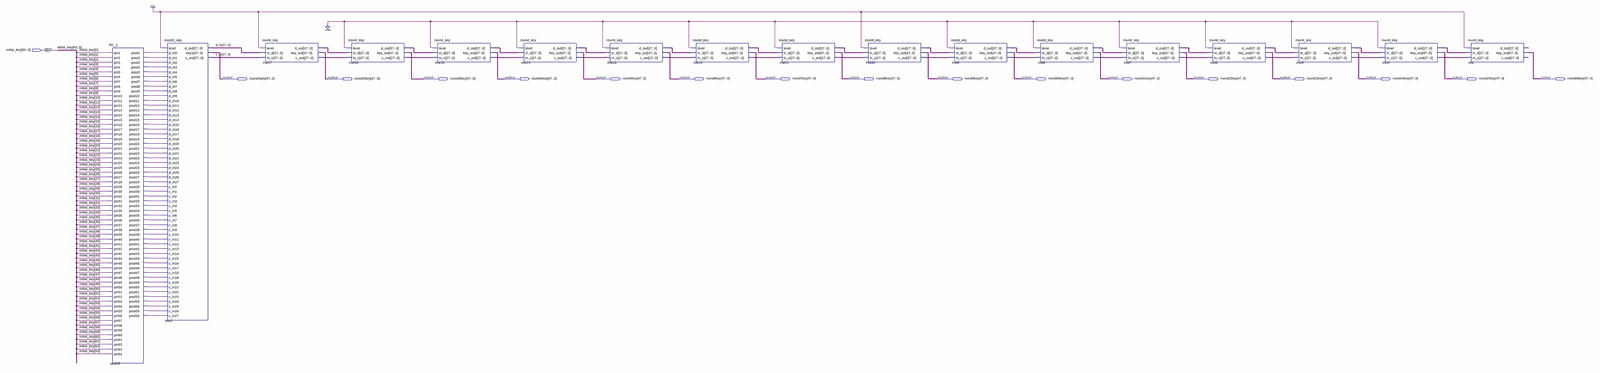
[diagram p0: schematic sheet, whole]
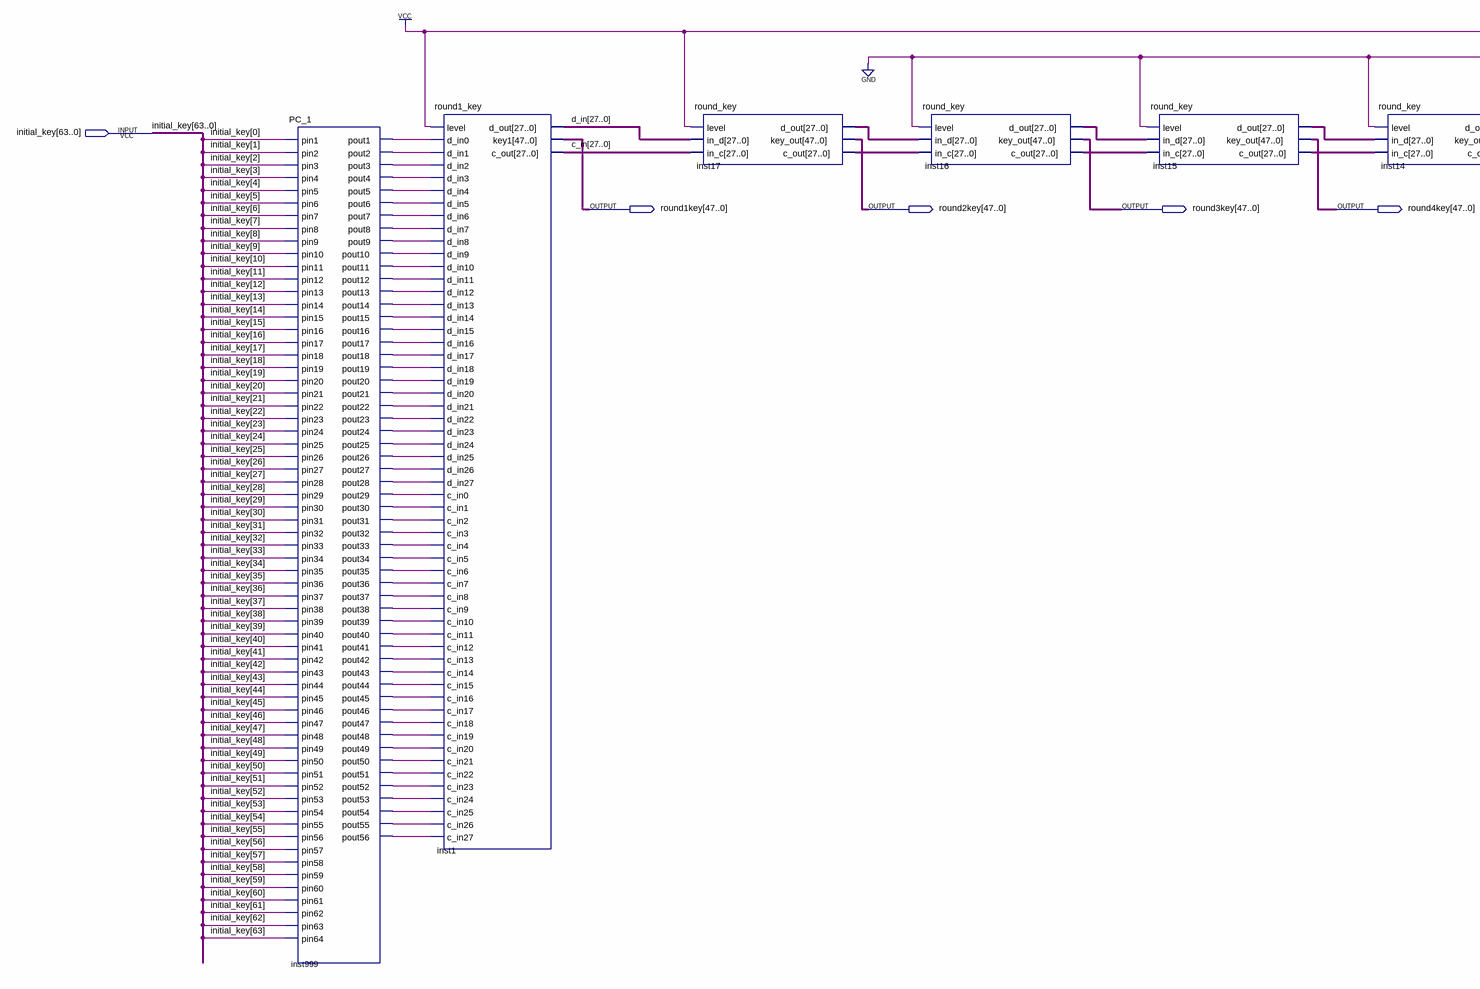
[diagram p1: schematic sheet, left part]
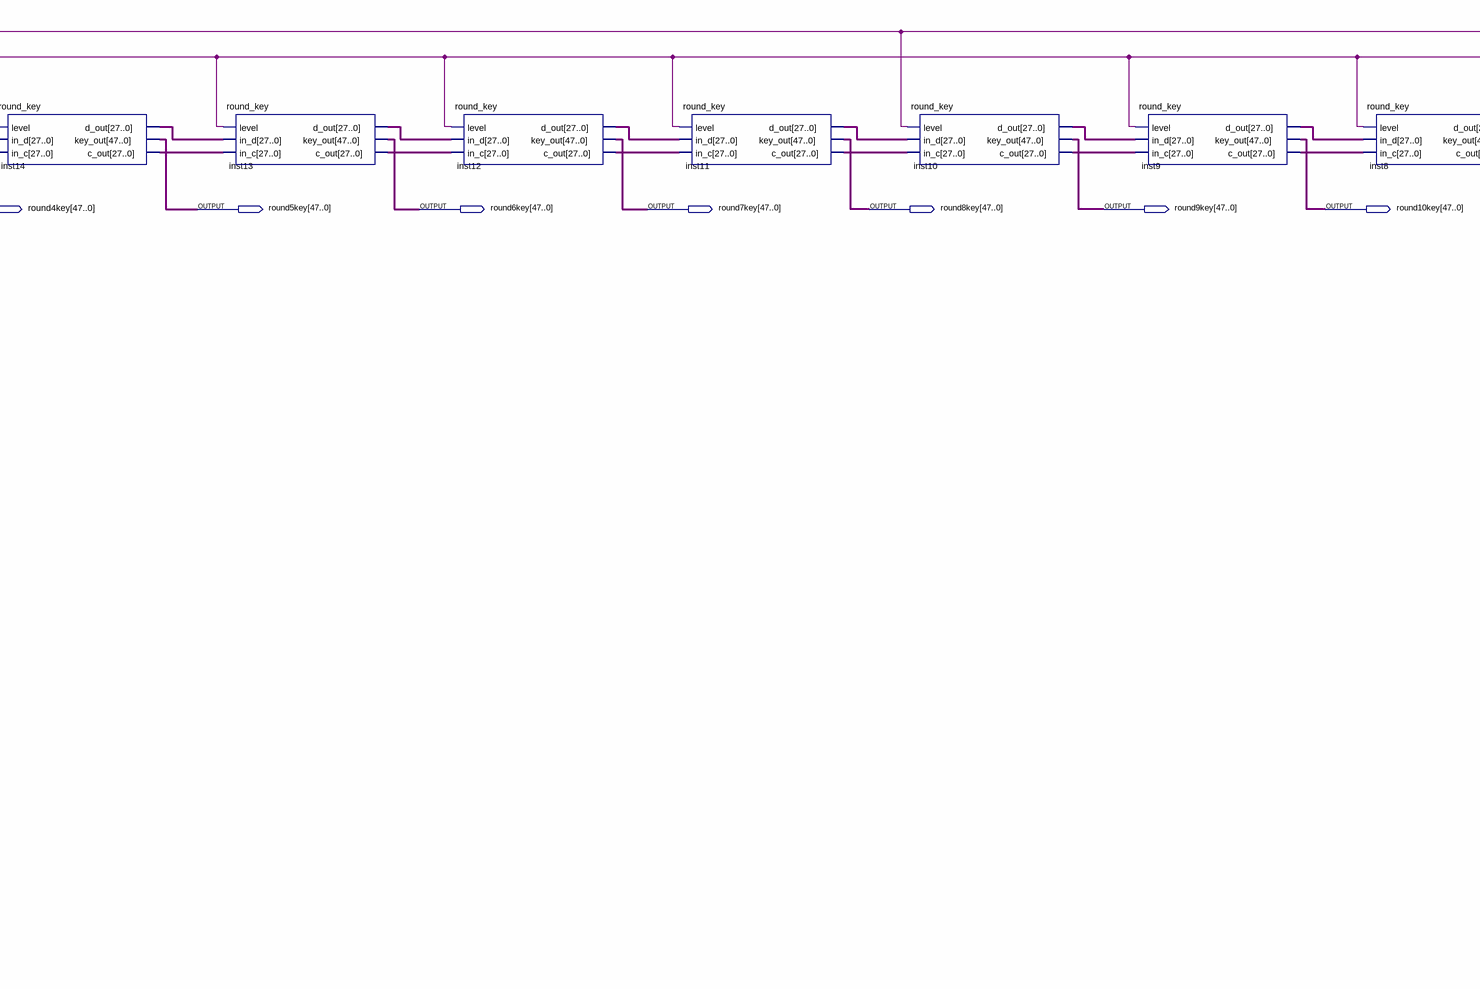
[diagram p2: schematic sheet, centre part]
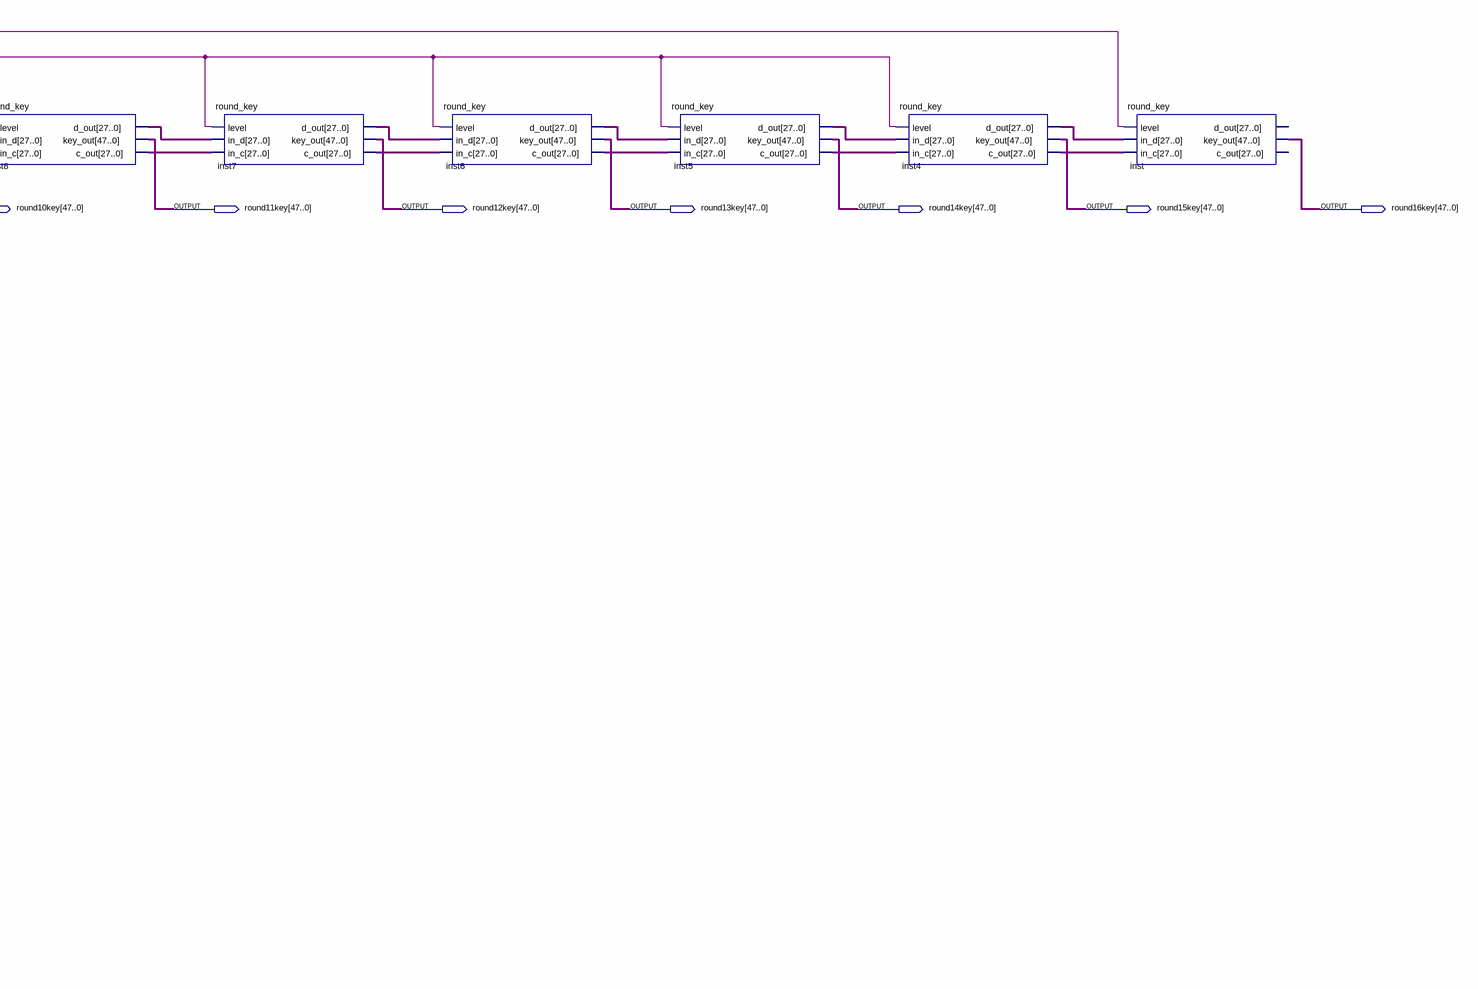
[diagram p3: schematic sheet, right part]
// Quartus schematic key_generator.bdf as structural Verilog: 17 symbols, 17 pins
module key_generator (
  input  [63:0] initial_key,
  output [47:0] round1key,
  output [47:0] round2key,
  output [47:0] round3key,
  output [47:0] round4key,
  output [47:0] round5key,
  output [47:0] round6key,
  output [47:0] round7key,
  output [47:0] round8key,
  output [47:0] round9key,
  output [47:0] round10key,
  output [47:0] round11key,
  output [47:0] round12key,
  output [47:0] round13key,
  output [47:0] round14key,
  output [47:0] round15key,
  output [47:0] round16key
);

  wire inst999_pout1, inst999_pout2, inst999_pout3, inst999_pout4, inst999_pout5, inst999_pout6,
       inst999_pout7, inst999_pout8, inst999_pout9, inst999_pout10, inst999_pout11, inst999_pout12,
       inst999_pout13, inst999_pout14, inst999_pout15, inst999_pout16, inst999_pout17, inst999_pout18,
       inst999_pout19, inst999_pout20, inst999_pout21, inst999_pout22, inst999_pout23, inst999_pout24,
       inst999_pout25, inst999_pout26, inst999_pout27, inst999_pout28, inst999_pout29, inst999_pout30,
       inst999_pout31, inst999_pout32, inst999_pout33, inst999_pout34, inst999_pout35, inst999_pout36,
       inst999_pout37, inst999_pout38, inst999_pout39, inst999_pout40, inst999_pout41, inst999_pout42,
       inst999_pout43, inst999_pout44, inst999_pout45, inst999_pout46, inst999_pout47, inst999_pout48,
       inst999_pout49, inst999_pout50, inst999_pout51, inst999_pout52, inst999_pout53, inst999_pout54,
       inst999_pout55, inst999_pout56;
  wire [27:0] c_in, d_in, inst4_c_out, inst4_d_out, inst5_c_out, inst5_d_out, inst6_c_out, inst6_d_out,
       inst7_c_out, inst7_d_out, inst8_c_out, inst8_d_out, inst9_c_out, inst9_d_out, inst10_c_out,
       inst10_d_out, inst11_c_out, inst11_d_out, inst12_c_out, inst12_d_out, inst13_c_out, inst13_d_out,
       inst14_c_out, inst14_d_out, inst15_c_out, inst15_d_out, inst16_c_out, inst16_d_out, inst17_c_out,
       inst17_d_out;

  PC_1 inst999 (
    .pin1(initial_key[0]), .pin2(initial_key[1]), .pin3(initial_key[2]), .pin4(initial_key[3]),
    .pin5(initial_key[4]), .pin6(initial_key[5]), .pin7(initial_key[6]), .pin8(initial_key[7]),
    .pin9(initial_key[8]), .pin10(initial_key[9]), .pin11(initial_key[10]), .pin12(initial_key[11]),
    .pin13(initial_key[12]), .pin14(initial_key[13]), .pin15(initial_key[14]), .pin16(initial_key[15]),
    .pin17(initial_key[16]), .pin18(initial_key[17]), .pin19(initial_key[18]), .pin20(initial_key[19]),
    .pin21(initial_key[20]), .pin22(initial_key[21]), .pin23(initial_key[22]), .pin24(initial_key[23]),
    .pin25(initial_key[24]), .pin26(initial_key[25]), .pin27(initial_key[26]), .pin28(initial_key[27]),
    .pin29(initial_key[28]), .pin30(initial_key[29]), .pin31(initial_key[30]), .pin32(initial_key[31]),
    .pin33(initial_key[32]), .pin34(initial_key[33]), .pin35(initial_key[34]), .pin36(initial_key[35]),
    .pin37(initial_key[36]), .pin38(initial_key[37]), .pin39(initial_key[38]), .pin40(initial_key[39]),
    .pin41(initial_key[40]), .pin42(initial_key[41]), .pin43(initial_key[42]), .pin44(initial_key[43]),
    .pin45(initial_key[44]), .pin46(initial_key[45]), .pin47(initial_key[46]), .pin48(initial_key[47]),
    .pin49(initial_key[48]), .pin50(initial_key[49]), .pin51(initial_key[50]), .pin52(initial_key[51]),
    .pin53(initial_key[52]), .pin54(initial_key[53]), .pin55(initial_key[54]), .pin56(initial_key[55]),
    .pin57(initial_key[56]), .pin58(initial_key[57]), .pin59(initial_key[58]), .pin60(initial_key[59]),
    .pin61(initial_key[60]), .pin62(initial_key[61]), .pin63(initial_key[62]), .pin64(initial_key[63]),
    .pout1(inst999_pout1), .pout2(inst999_pout2), .pout3(inst999_pout3), .pout4(inst999_pout4),
    .pout5(inst999_pout5), .pout6(inst999_pout6), .pout7(inst999_pout7), .pout8(inst999_pout8),
    .pout9(inst999_pout9), .pout10(inst999_pout10), .pout11(inst999_pout11), .pout12(inst999_pout12),
    .pout13(inst999_pout13), .pout14(inst999_pout14), .pout15(inst999_pout15), .pout16(inst999_pout16),
    .pout17(inst999_pout17), .pout18(inst999_pout18), .pout19(inst999_pout19), .pout20(inst999_pout20),
    .pout21(inst999_pout21), .pout22(inst999_pout22), .pout23(inst999_pout23), .pout24(inst999_pout24),
    .pout25(inst999_pout25), .pout26(inst999_pout26), .pout27(inst999_pout27), .pout28(inst999_pout28),
    .pout29(inst999_pout29), .pout30(inst999_pout30), .pout31(inst999_pout31), .pout32(inst999_pout32),
    .pout33(inst999_pout33), .pout34(inst999_pout34), .pout35(inst999_pout35), .pout36(inst999_pout36),
    .pout37(inst999_pout37), .pout38(inst999_pout38), .pout39(inst999_pout39), .pout40(inst999_pout40),
    .pout41(inst999_pout41), .pout42(inst999_pout42), .pout43(inst999_pout43), .pout44(inst999_pout44),
    .pout45(inst999_pout45), .pout46(inst999_pout46), .pout47(inst999_pout47), .pout48(inst999_pout48),
    .pout49(inst999_pout49), .pout50(inst999_pout50), .pout51(inst999_pout51), .pout52(inst999_pout52),
    .pout53(inst999_pout53), .pout54(inst999_pout54), .pout55(inst999_pout55), .pout56(inst999_pout56));
  round1_key inst1 (
    .level(1'b1), .d_in0(inst999_pout1), .d_in1(inst999_pout2), .d_in2(inst999_pout3), .d_in3(inst999_pout4),
    .d_in4(inst999_pout5), .d_in5(inst999_pout6), .d_in6(inst999_pout7), .d_in7(inst999_pout8),
    .d_in8(inst999_pout9), .d_in9(inst999_pout10), .d_in10(inst999_pout11), .d_in11(inst999_pout12),
    .d_in12(inst999_pout13), .d_in13(inst999_pout14), .d_in14(inst999_pout15), .d_in15(inst999_pout16),
    .d_in16(inst999_pout17), .d_in17(inst999_pout18), .d_in18(inst999_pout19), .d_in19(inst999_pout20),
    .d_in20(inst999_pout21), .d_in21(inst999_pout22), .d_in22(inst999_pout23), .d_in23(inst999_pout24),
    .d_in24(inst999_pout25), .d_in25(inst999_pout26), .d_in26(inst999_pout27), .d_in27(inst999_pout28),
    .c_in0(inst999_pout29), .c_in1(inst999_pout30), .c_in2(inst999_pout31), .c_in3(inst999_pout32),
    .c_in4(inst999_pout33), .c_in5(inst999_pout34), .c_in6(inst999_pout35), .c_in7(inst999_pout36),
    .c_in8(inst999_pout37), .c_in9(inst999_pout38), .c_in10(inst999_pout39), .c_in11(inst999_pout40),
    .c_in12(inst999_pout41), .c_in13(inst999_pout42), .c_in14(inst999_pout43), .c_in15(inst999_pout44),
    .c_in16(inst999_pout45), .c_in17(inst999_pout46), .c_in18(inst999_pout47), .c_in19(inst999_pout48),
    .c_in20(inst999_pout49), .c_in21(inst999_pout50), .c_in22(inst999_pout51), .c_in23(inst999_pout52),
    .c_in24(inst999_pout53), .c_in25(inst999_pout54), .c_in26(inst999_pout55), .c_in27(inst999_pout56),
    .d_out(d_in), .key1(round1key), .c_out(c_in));
  round_key inst17 (
    .level(1'b1), .in_d(d_in), .in_c(c_in), .d_out(inst17_d_out), .key_out(round2key), .c_out(inst17_c_out));
  round_key inst16 (
    .level(1'b0), .in_d(inst17_d_out), .in_c(inst17_c_out), .d_out(inst16_d_out), .key_out(round3key),
    .c_out(inst16_c_out));
  round_key inst15 (
    .level(1'b0), .in_d(inst16_d_out), .in_c(inst16_c_out), .d_out(inst15_d_out), .key_out(round4key),
    .c_out(inst15_c_out));
  round_key inst14 (
    .level(1'b0), .in_d(inst15_d_out), .in_c(inst15_c_out), .d_out(inst14_d_out), .key_out(round5key),
    .c_out(inst14_c_out));
  round_key inst13 (
    .level(1'b0), .in_d(inst14_d_out), .in_c(inst14_c_out), .d_out(inst13_d_out), .key_out(round6key),
    .c_out(inst13_c_out));
  round_key inst12 (
    .level(1'b0), .in_d(inst13_d_out), .in_c(inst13_c_out), .d_out(inst12_d_out), .key_out(round7key),
    .c_out(inst12_c_out));
  round_key inst11 (
    .level(1'b0), .in_d(inst12_d_out), .in_c(inst12_c_out), .d_out(inst11_d_out), .key_out(round8key),
    .c_out(inst11_c_out));
  round_key inst10 (
    .level(1'b1), .in_d(inst11_d_out), .in_c(inst11_c_out), .d_out(inst10_d_out), .key_out(round9key),
    .c_out(inst10_c_out));
  round_key inst9 (
    .level(1'b0), .in_d(inst10_d_out), .in_c(inst10_c_out), .d_out(inst9_d_out), .key_out(round10key),
    .c_out(inst9_c_out));
  round_key inst8 (
    .level(1'b0), .in_d(inst9_d_out), .in_c(inst9_c_out), .d_out(inst8_d_out), .key_out(round11key),
    .c_out(inst8_c_out));
  round_key inst7 (
    .level(1'b0), .in_d(inst8_d_out), .in_c(inst8_c_out), .d_out(inst7_d_out), .key_out(round12key),
    .c_out(inst7_c_out));
  round_key inst6 (
    .level(1'b0), .in_d(inst7_d_out), .in_c(inst7_c_out), .d_out(inst6_d_out), .key_out(round13key),
    .c_out(inst6_c_out));
  round_key inst5 (
    .level(1'b0), .in_d(inst6_d_out), .in_c(inst6_c_out), .d_out(inst5_d_out), .key_out(round14key),
    .c_out(inst5_c_out));
  round_key inst4 (
    .level(1'b0), .in_d(inst5_d_out), .in_c(inst5_c_out), .d_out(inst4_d_out), .key_out(round15key),
    .c_out(inst4_c_out));
  round_key inst (.level(1'b1), .in_d(inst4_d_out), .in_c(inst4_c_out), .key_out(round16key));  // open: d_out, c_out
endmodule
